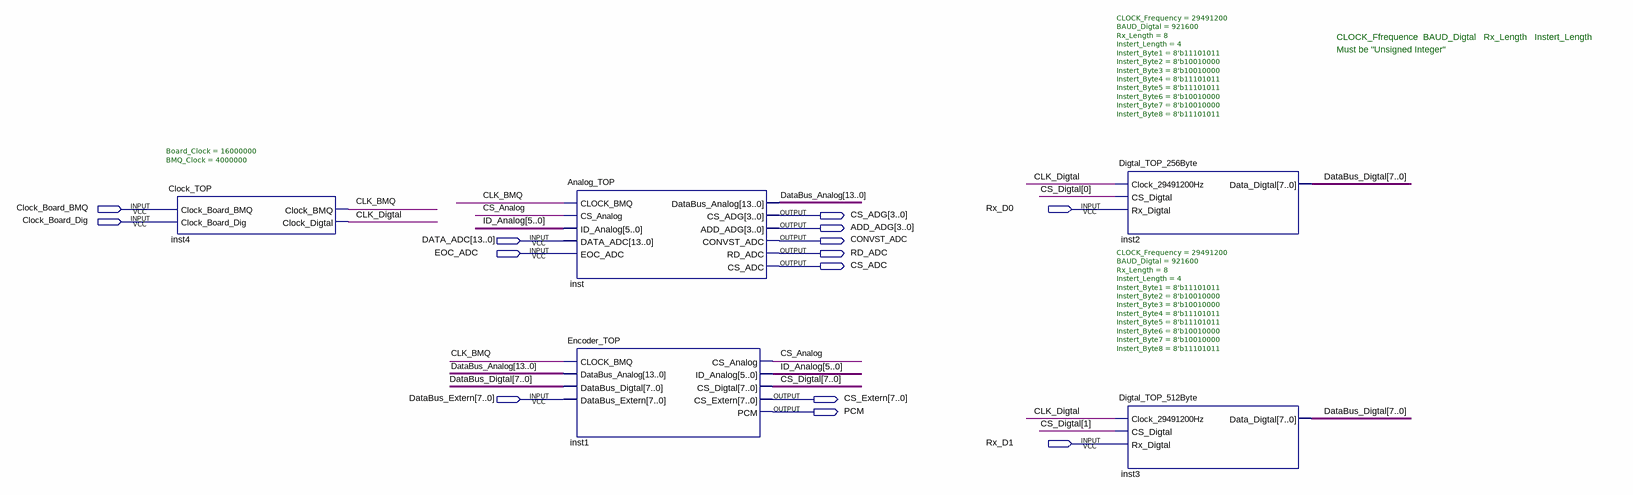
[diagram p0: schematic sheet]
// Quartus schematic TOP.bdf as structural Verilog: 5 symbols, 14 pins
module TOP (
  input  Clock_Board_BMQ,
  input  Rx_D0,
  input  Clock_Board_Dig,
  input  [13:0] DATA_ADC,
  input  EOC_ADC,
  input  [7:0] DataBus_Extern,
  input  Rx_D1,
  output [3:0] CS_ADG,
  output [3:0] ADD_ADG,
  output CONVST_ADC,
  output RD_ADC,
  output CS_ADC,
  output [7:0] CS_Extern,
  output PCM
);

  wire CLK_BMQ, CLK_Digtal, CS_Analog;
  wire [5:0] ID_Analog;
  wire [7:0] CS_Digtal, DataBus_Digtal;
  wire [13:0] DataBus_Analog;

  Clock_TOP #(.Board_Clock(16000000), .BMQ_Clock(4000000)) inst4 (
    .Clock_Board_BMQ(Clock_Board_BMQ), .Clock_Board_Dig(Clock_Board_Dig), .Clock_BMQ(CLK_BMQ),
    .Clock_Digtal(CLK_Digtal));
  Analog_TOP inst (
    .CLOCK_BMQ(CLK_BMQ), .CS_Analog(CS_Analog), .ID_Analog(ID_Analog), .DATA_ADC(DATA_ADC),
    .EOC_ADC(EOC_ADC), .DataBus_Analog(DataBus_Analog), .CS_ADG(CS_ADG), .ADD_ADG(ADD_ADG),
    .CONVST_ADC(CONVST_ADC), .RD_ADC(RD_ADC), .CS_ADC(CS_ADC));
  Encoder_TOP inst1 (
    .CLOCK_BMQ(CLK_BMQ), .DataBus_Analog(DataBus_Analog), .DataBus_Digtal(DataBus_Digtal),
    .DataBus_Extern(DataBus_Extern), .CS_Analog(CS_Analog), .ID_Analog(ID_Analog), .CS_Digtal(CS_Digtal),
    .CS_Extern(CS_Extern), .PCM(PCM));
  Digtal_TOP_256Byte #(.CLOCK_Frequency(29491200), .BAUD_Digtal(921600), .Rx_Length(8), .Instert_Length(4), .Instert_Byte1(8'b11101011), .Instert_Byte2(8'b10010000), .Instert_Byte3(8'b10010000), .Instert_Byte4(8'b11101011), .Instert_Byte5(8'b11101011), .Instert_Byte6(8'b10010000), .Instert_Byte7(8'b10010000), .Instert_Byte8(8'b11101011)) inst2 (
    .Clock_29491200Hz(CLK_Digtal), .CS_Digtal(CS_Digtal[0]), .Rx_Digtal(Rx_D0), .Data_Digtal(DataBus_Digtal));
  Digtal_TOP_512Byte #(.CLOCK_Frequency(29491200), .BAUD_Digtal(921600), .Rx_Length(8), .Instert_Length(4), .Instert_Byte1(8'b11101011), .Instert_Byte2(8'b10010000), .Instert_Byte3(8'b10010000), .Instert_Byte4(8'b11101011), .Instert_Byte5(8'b11101011), .Instert_Byte6(8'b10010000), .Instert_Byte7(8'b10010000), .Instert_Byte8(8'b11101011)) inst3 (
    .Clock_29491200Hz(CLK_Digtal), .CS_Digtal(CS_Digtal[1]), .Rx_Digtal(Rx_D1), .Data_Digtal(DataBus_Digtal));

  // Notes on the sheet:
  //   CLOCK_Ffrequence  BAUD_Digtal   Rx_Length   Instert_Length
  //   Must be "Unsigned Integer"
endmodule
